# EAGLE design schematic (EAGLE 6.5.0)
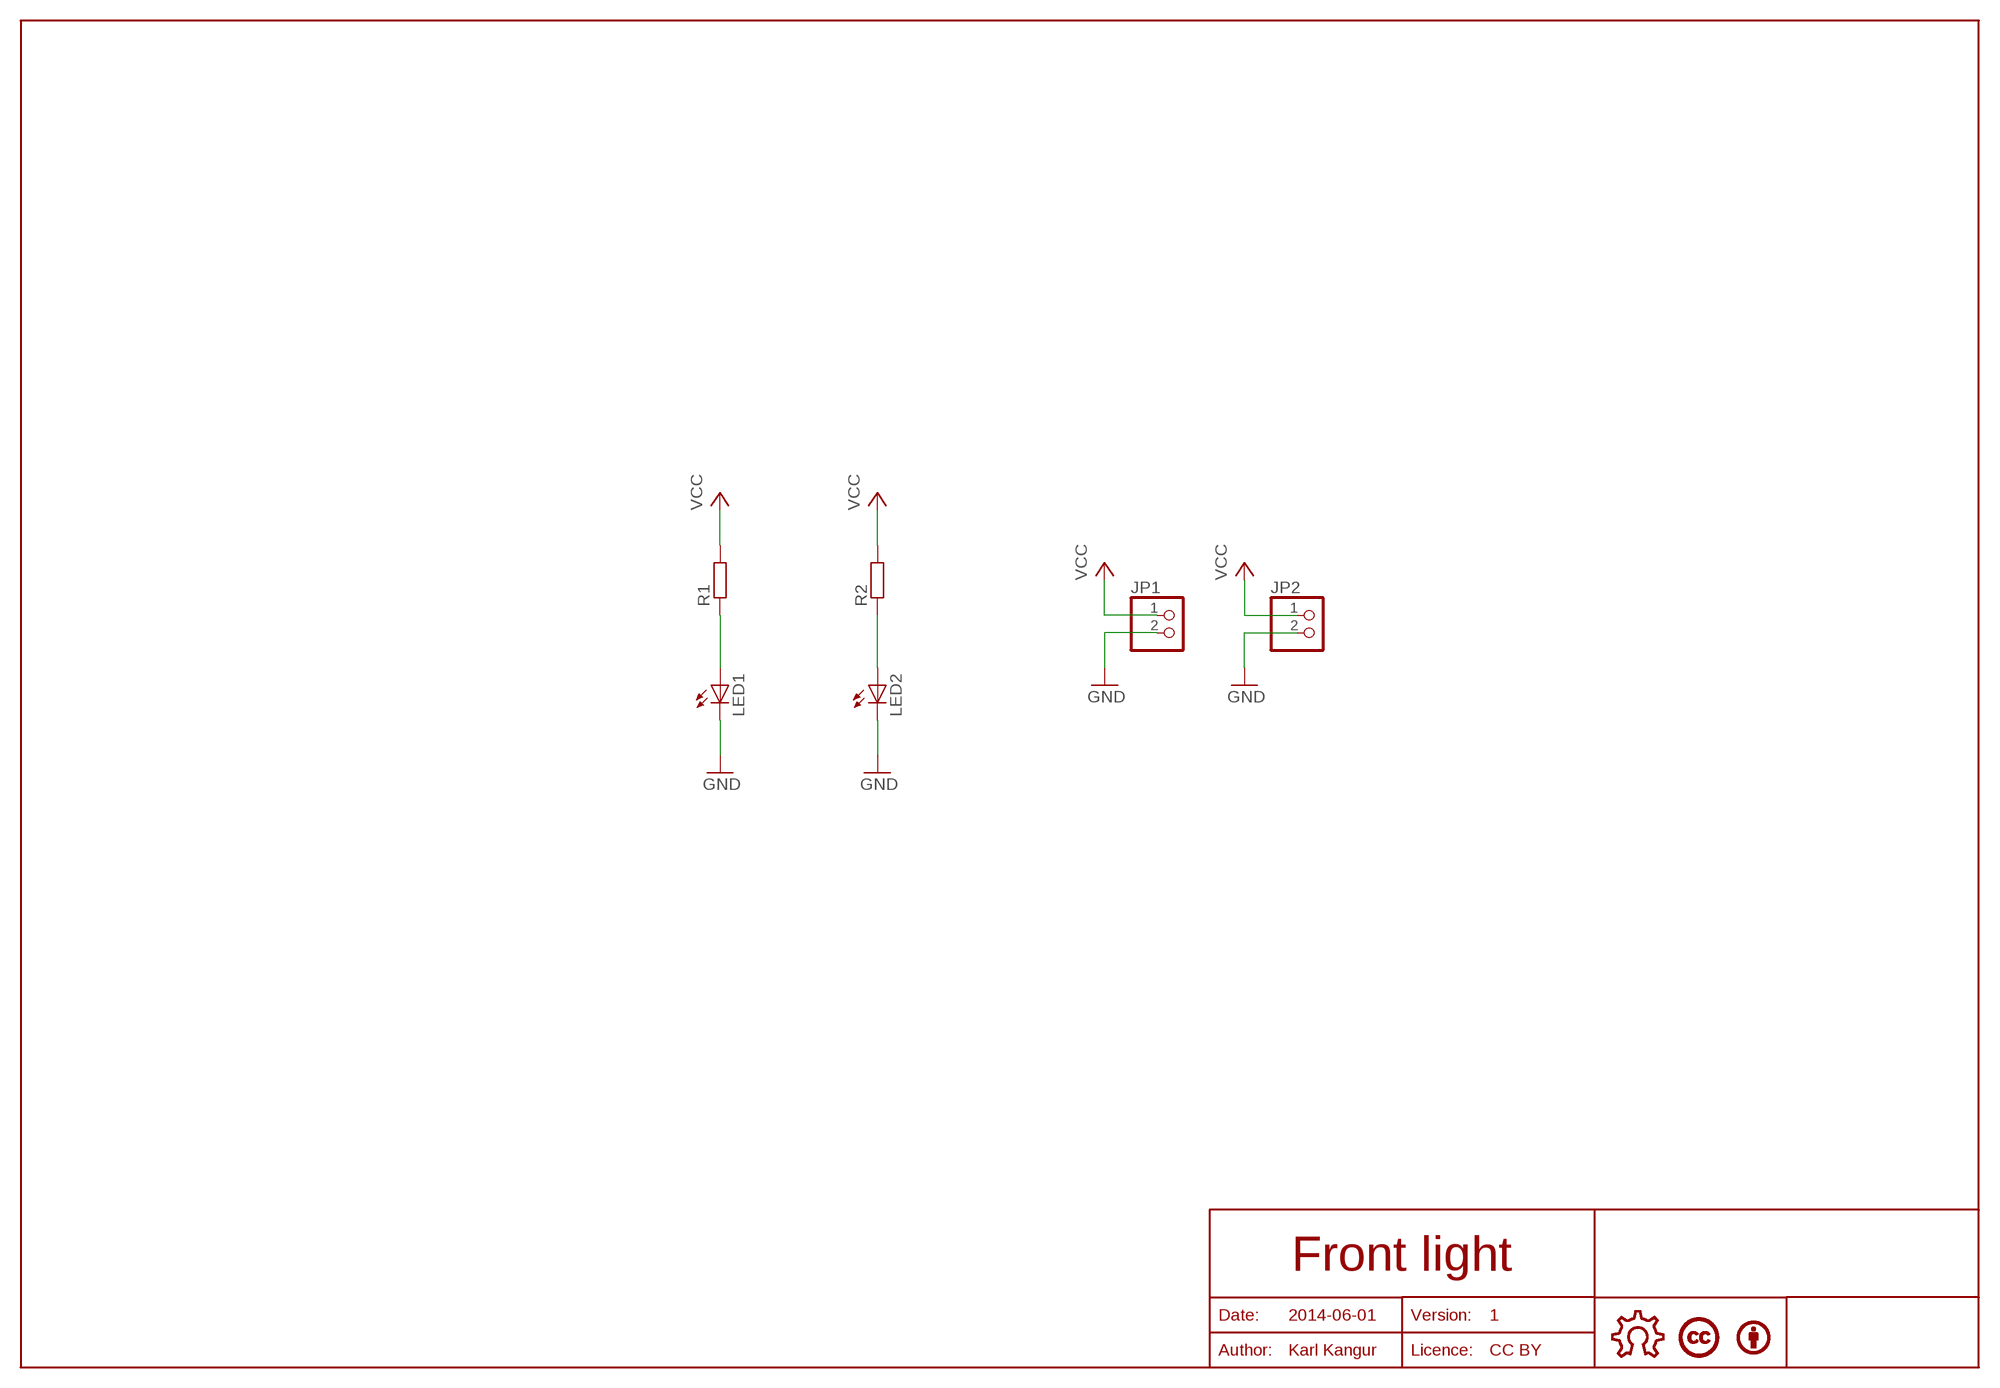
[diagram p0: schematic, sheet 1]

## Parts
BY1  BYBOTTOM  [BY]
JP1  PINHD-1X2  [1X02]
JP2  PINHD-1X2  [1X02]
LED1  LED5MM  [LED5MM]
LED2  LED5MM  [LED5MM]
LICENCE1  LICENCECC-BOTTOM  [CREATIVE-COMMONS]
R1  R-EU_0207/7  [0207/7]
R2  R-EU_0207/7  [0207/7]
U$10  OPEN-HARDWARE-LOGOBOTTOM-SMALL  [OPEN-HARDWARE-BOTTOM-SMALL]

## Nets
GND: JP1.2 JP2.2 LED1.K(C) LED2.K(C)
N$1: LED1.A R1.1
N$2: LED2.A R2.1
VCC: JP1.1 JP2.1 R1.2 R2.2

## Notes on the sheet
- Front light
- Date: | 2014-06-01 | Version: | 1
- Author: | Karl Kangur | Licence: | CC BY

## Library data of the parts
BY1 = robopoly:BY
JP1 JP2 = pinhead:PINHD-1X2: PIN HEADER
LED1 LED2 = led:LED: LED OSRAM: - CHIPLED LG R971, LG N971, LY N971, LG Q971, LY Q971, LO R971, LY R971 LH N974, LH R974 LS Q976, LO Q976, LY Q976 LO Q996 - Hyper CHIPLED LW Q18S LB Q993, LB Q99A, LB R99A - SideLED LS A670, LO A670, LY A670, LG A670, LP A670 LB A673, LV A673, LT A673, LW A673 LH A674 LY A675 LS A676, LA A676, LO A676, LY A676, LW A676 LS A679, LY A679, LG A679 - Hyper Micro SIDELED® LS Y876, LA Y876, LO Y876, LY Y876 LT Y87S - SmartLED LW L88C, LW L88S LB L89C, LB L89S, LG L890 LS L89K, LO L89K, LY L89K LS L896, LA L896, LO L896, LY L896 - TOPLED LS T670, LO T670, LY T670, LG T670, LP T670 LSG T670, LSP T670, LSY T670, LOP T670, LYG T670 LG T671, LOG T671, LSG T671 LB T673, LV T673, LT T673, LW T673 LH T674 LS T676, LA T676, LO T676, LY T676, LB T676, LH T676, LSB T676, LW T676 LB T67C, LV T67C, LT T67C, LS T67K, LO T67K, LY T67K, LW E67C LS E67B, LA E67B, LO E67B, LY E67B, LB E67C, LV E67C, LT E67C LW T67C LS T679, LY T679, LG T679 LS T770, LO T770, LY T770, LG T770, LP T770 LB T773, LV T773, LT T773, LW T773 LH T774 LS E675, LA E675, LY E675, LS T675 LS T776, LA T776, LO T776, LY T776, LB T776 LHGB T686 LT T68C, LB T68C - Hyper Mini TOPLED® LB M676 - Mini TOPLED Santana® LG M470 LS M47K, LO M47K, LY M47K Source: http://www.osram.convergy.de LUXEON: - LUMILED® LXK2-PW12-R00, LXK2-PW12-S00, LXK2-PW14-U00, LXK2-PW14-V00 LXK2-PM12-R00, LXK2-PM12-S00, LXK2-PM14-U00 LXK2-PE12-Q00, LXK2-PE12-R00, LXK2-PE12-S00, LXK2-PE14-T00, LXK2-PE14-U00 LXK2-PB12-K00, LXK2-PB12-L00, LXK2-PB12-M00, LXK2-PB14-N00, LXK2-PB14-P00, LXK2-PB14-Q00 LXK2-PR12-L00, LXK2-PR12-M00, LXK2-PR14-Q00, LXK2-PR14-R00 LXK2-PD12-Q00, LXK2-PD12-R00, LXK2-PD12-S00 LXK2-PH12-R00, LXK2-PH12-S00 LXK2-PL12-P00, LXK2-PL12-Q00, LXK2-PL12-R00 Source: www.luxeon.com KINGBRIGHT: KA-3528ASYC Source: www.kingbright.com
LICENCE1 = robopoly:LICENCE
R1 R2 = rcl:R-EU_: RESISTOR, European symbol
U$10 = robopoly:OPEN-HARDWARE-LOGO

## Board
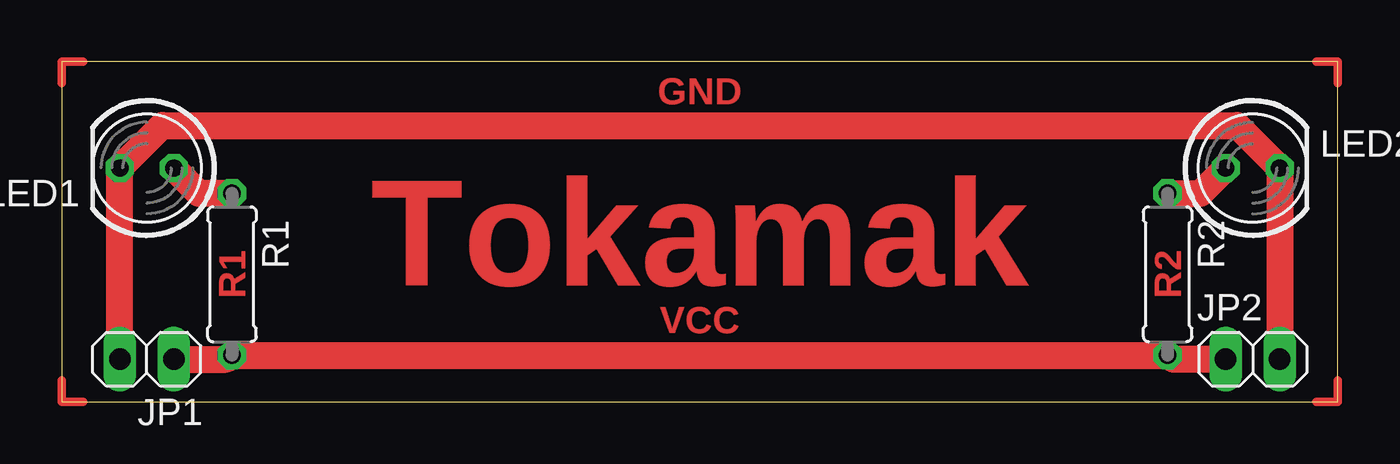
[diagram p1: board, top side]
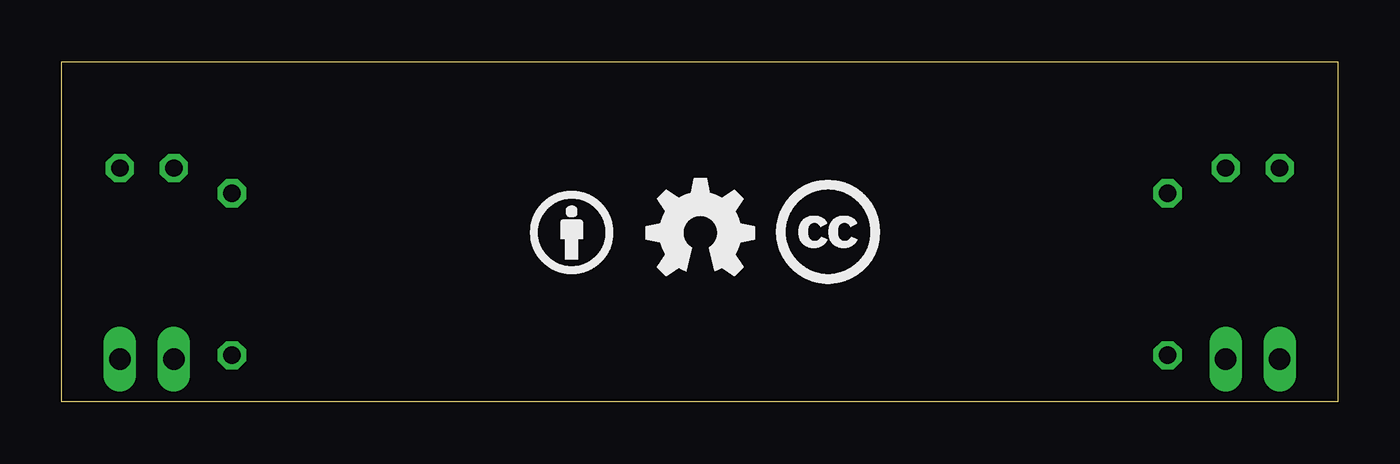
[diagram p2: board, bottom side, seen from below]

Size 60 x 16 mm. Coordinates in mm from the lower left corner, seen from the top.
Outline: 0,0 60,0 60,16 0,16 0,0
Copper layers (1*16): Top 0.035mm / dielectric 1.5mm / Bottom 0.035mm
Design rules "default": minimum track width 10mil, minimum drill 24mil, track to track 8mil, track to pad 8mil, pad to pad 8mil, via to via 8mil, smd to smd 8mil, copper to edge 40mil, drill to drill 8mil, minimum pad ring 10mil, minimum via ring 8mil, stop-mask expansion 4mil, vias tented up to drill 0mil, thermal gap 10mil

### Footprints (pad centres in the part's own frame; a part is rotated, then mirrored left to right if it is on the bottom)
1X02 = drill 1.016 long: 1 -1.27,0; 2 1.27,0
LED5MM = drill 0.813 octagon: A -1.27,0; K 1.27,0
0207/7 = drill 0.813 octagon: 1 -3.81,0; 2 3.81,0

### Placement (x,y rotation side)
BY1  36,8 0 top
JP1  4,2 180 top
JP2  56,2 0 top
LED1  4,11 180 top
LED2  56,11 0 top
LICENCE1  24,8 0 top
R1  8,6 270 top
R2  52,6 270 top
U$10  30,8 0 top

### Tracks (layer width: path | path; a pad name or v marks a point on that pad's centre or on a via)
GND
  Top 1.27: JP1.2 LED1.K 4.73,13 55.27,13 LED2.K JP2.2
N$1
  Top 1.27: R1.1 6.46,9.81 LED1.A
N$2
  Top 1.27: R2.1 53.54,9.81 LED2.A
N$3
  Top 0.406: 0,15 0,16 1,16
N$4
  Top 0.406: 60,15 60,16 59,16
N$5
  Top 0.406: 60,1 60,0 59,0
N$6
  Top 0.406: 0,1 0,0 1,0
VCC
  Top 1.27: JP1.1 7.71,2 R1.2 R2.2 52.28,2 JP2.1

### Text on the board
Top: GND | Tokamak | R1 | R2 | VCC